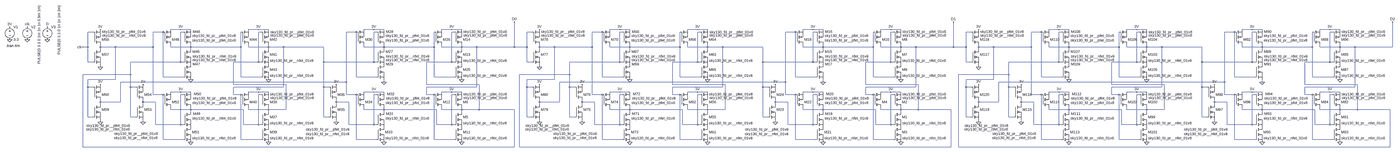
[diagram p0: schematic FETDFF(debug).asc, whole sheet]
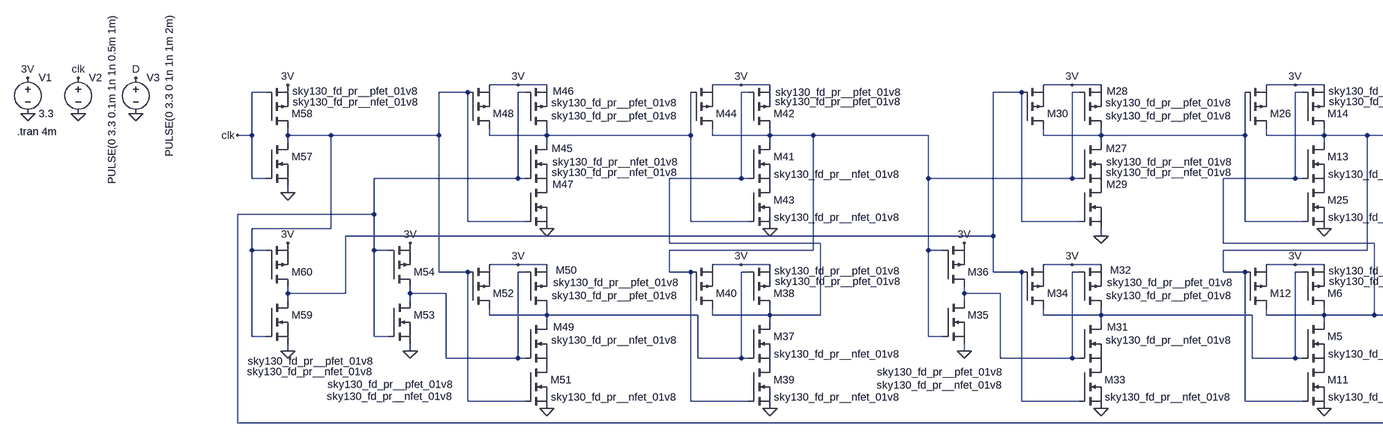
[diagram p1: schematic FETDFF(debug).asc, part, row 1 of 1, column 1 of 3]
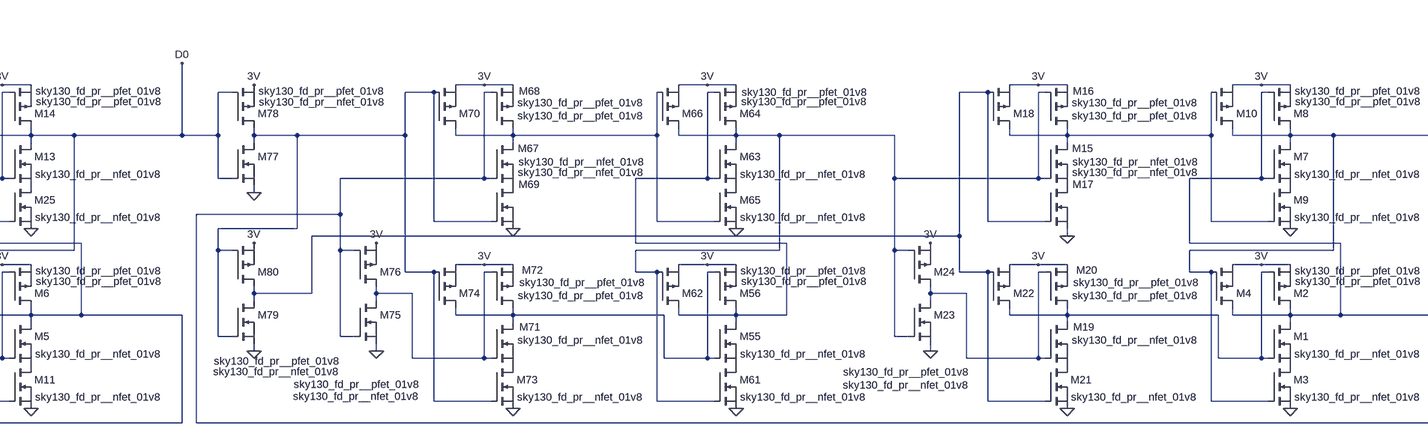
[diagram p2: schematic FETDFF(debug).asc, part, row 1 of 1, column 2 of 3]
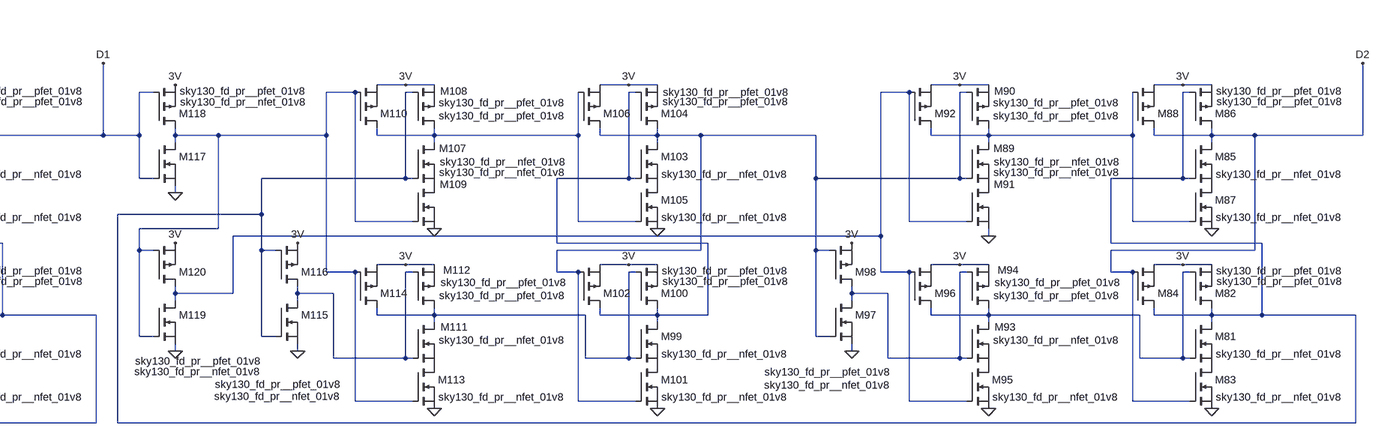
[diagram p3: schematic FETDFF(debug).asc, part, row 1 of 1, column 3 of 3]
FETDFF(debug).asc, the LTspice schematic file:
Version 4
SHEET 1 8612 680
WIRE 112 -1616 48 -1616
WIRE 176 -1616 112 -1616
WIRE 608 -1616 544 -1616
WIRE 672 -1616 608 -1616
WIRE 1344 -1616 1280 -1616
WIRE 1408 -1616 1344 -1616
WIRE 1840 -1616 1776 -1616
WIRE 1904 -1616 1840 -1616
WIRE 2912 -1616 2848 -1616
WIRE 2976 -1616 2912 -1616
WIRE 3408 -1616 3344 -1616
WIRE 3472 -1616 3408 -1616
WIRE 4144 -1616 4080 -1616
WIRE 4208 -1616 4144 -1616
WIRE 4640 -1616 4576 -1616
WIRE 4704 -1616 4640 -1616
WIRE 5712 -1616 5648 -1616
WIRE 5776 -1616 5712 -1616
WIRE 6208 -1616 6144 -1616
WIRE 6272 -1616 6208 -1616
WIRE 6944 -1616 6880 -1616
WIRE 7008 -1616 6944 -1616
WIRE 7440 -1616 7376 -1616
WIRE 7504 -1616 7440 -1616
WIRE -448 -1600 -480 -1600
WIRE 0 -1600 -64 -1600
WIRE 128 -1600 112 -1600
WIRE 624 -1600 608 -1600
WIRE 1232 -1600 1168 -1600
WIRE 1360 -1600 1344 -1600
WIRE 1856 -1600 1840 -1600
WIRE 2352 -1600 2320 -1600
WIRE 2800 -1600 2736 -1600
WIRE 2928 -1600 2912 -1600
WIRE 3424 -1600 3408 -1600
WIRE 4032 -1600 3968 -1600
WIRE 4160 -1600 4144 -1600
WIRE 4656 -1600 4640 -1600
WIRE 5152 -1600 5120 -1600
WIRE 5600 -1600 5536 -1600
WIRE 5728 -1600 5712 -1600
WIRE 6224 -1600 6208 -1600
WIRE 6832 -1600 6768 -1600
WIRE 6960 -1600 6944 -1600
WIRE 7456 -1600 7440 -1600
WIRE -480 -1504 -480 -1600
WIRE -480 -1504 -512 -1504
WIRE -400 -1504 -400 -1520
WIRE -304 -1504 -400 -1504
WIRE -64 -1504 -64 -1600
WIRE -64 -1504 -304 -1504
WIRE 48 -1504 48 -1520
WIRE 176 -1504 176 -1520
WIRE 176 -1504 48 -1504
WIRE 496 -1504 496 -1600
WIRE 496 -1504 176 -1504
WIRE 544 -1504 544 -1520
WIRE 672 -1504 672 -1520
WIRE 672 -1504 544 -1504
WIRE 768 -1504 672 -1504
WIRE 1024 -1504 768 -1504
WIRE 1280 -1504 1280 -1520
WIRE 1408 -1504 1408 -1520
WIRE 1408 -1504 1280 -1504
WIRE 1728 -1504 1728 -1600
WIRE 1728 -1504 1408 -1504
WIRE 1776 -1504 1776 -1520
WIRE 1904 -1504 1904 -1520
WIRE 1904 -1504 1776 -1504
WIRE 2000 -1504 1904 -1504
WIRE 2240 -1504 2240 -1664
WIRE 2240 -1504 2000 -1504
WIRE 2320 -1504 2320 -1600
WIRE 2320 -1504 2240 -1504
WIRE 2400 -1504 2400 -1520
WIRE 2496 -1504 2400 -1504
WIRE 2736 -1504 2736 -1600
WIRE 2736 -1504 2496 -1504
WIRE 2848 -1504 2848 -1520
WIRE 2976 -1504 2976 -1520
WIRE 2976 -1504 2848 -1504
WIRE 3296 -1504 3296 -1600
WIRE 3296 -1504 2976 -1504
WIRE 3344 -1504 3344 -1520
WIRE 3472 -1504 3472 -1520
WIRE 3472 -1504 3344 -1504
WIRE 3568 -1504 3472 -1504
WIRE 3824 -1504 3568 -1504
WIRE 4080 -1504 4080 -1520
WIRE 4208 -1504 4208 -1520
WIRE 4208 -1504 4080 -1504
WIRE 4528 -1504 4528 -1600
WIRE 4528 -1504 4208 -1504
WIRE 4576 -1504 4576 -1520
WIRE 4704 -1504 4704 -1520
WIRE 4704 -1504 4576 -1504
WIRE 4800 -1504 4704 -1504
WIRE 5040 -1504 5040 -1664
WIRE 5040 -1504 4800 -1504
WIRE 5120 -1504 5120 -1600
WIRE 5120 -1504 5040 -1504
WIRE 5200 -1504 5200 -1520
WIRE 5296 -1504 5200 -1504
WIRE 5536 -1504 5536 -1600
WIRE 5536 -1504 5296 -1504
WIRE 5648 -1504 5648 -1520
WIRE 5776 -1504 5776 -1520
WIRE 5776 -1504 5648 -1504
WIRE 6096 -1504 6096 -1600
WIRE 6096 -1504 5776 -1504
WIRE 6144 -1504 6144 -1520
WIRE 6272 -1504 6272 -1520
WIRE 6272 -1504 6144 -1504
WIRE 6368 -1504 6272 -1504
WIRE 6624 -1504 6368 -1504
WIRE 6880 -1504 6880 -1520
WIRE 7008 -1504 7008 -1520
WIRE 7008 -1504 6880 -1504
WIRE 7328 -1504 7328 -1600
WIRE 7328 -1504 7008 -1504
WIRE 7376 -1504 7376 -1520
WIRE 7504 -1504 7504 -1520
WIRE 7504 -1504 7376 -1504
WIRE 7600 -1504 7504 -1504
WIRE 7840 -1504 7840 -1664
WIRE 7840 -1504 7600 -1504
WIRE -400 -1488 -400 -1504
WIRE 176 -1488 176 -1504
WIRE 672 -1488 672 -1504
WIRE 1408 -1488 1408 -1504
WIRE 1904 -1488 1904 -1504
WIRE 2400 -1488 2400 -1504
WIRE 2976 -1488 2976 -1504
WIRE 3472 -1488 3472 -1504
WIRE 4208 -1488 4208 -1504
WIRE 4704 -1488 4704 -1504
WIRE 5200 -1488 5200 -1504
WIRE 5776 -1488 5776 -1504
WIRE 6272 -1488 6272 -1504
WIRE 7008 -1488 7008 -1504
WIRE 7504 -1488 7504 -1504
WIRE -480 -1408 -480 -1504
WIRE -448 -1408 -480 -1408
WIRE 112 -1408 112 -1600
WIRE 112 -1408 -208 -1408
WIRE 128 -1408 112 -1408
WIRE 608 -1408 608 -1600
WIRE 608 -1408 448 -1408
WIRE 624 -1408 608 -1408
WIRE 1024 -1408 1024 -1504
WIRE 1344 -1408 1344 -1600
WIRE 1344 -1408 1024 -1408
WIRE 1360 -1408 1344 -1408
WIRE 1840 -1408 1840 -1600
WIRE 1840 -1408 1680 -1408
WIRE 1856 -1408 1840 -1408
WIRE 2320 -1408 2320 -1504
WIRE 2352 -1408 2320 -1408
WIRE 2912 -1408 2912 -1600
WIRE 2912 -1408 2592 -1408
WIRE 2928 -1408 2912 -1408
WIRE 3408 -1408 3408 -1600
WIRE 3408 -1408 3248 -1408
WIRE 3424 -1408 3408 -1408
WIRE 3824 -1408 3824 -1504
WIRE 4144 -1408 4144 -1600
WIRE 4144 -1408 3824 -1408
WIRE 4160 -1408 4144 -1408
WIRE 4640 -1408 4640 -1600
WIRE 4640 -1408 4480 -1408
WIRE 4656 -1408 4640 -1408
WIRE 5120 -1408 5120 -1504
WIRE 5152 -1408 5120 -1408
WIRE 5712 -1408 5712 -1600
WIRE 5712 -1408 5392 -1408
WIRE 5728 -1408 5712 -1408
WIRE 6208 -1408 6208 -1600
WIRE 6208 -1408 6048 -1408
WIRE 6224 -1408 6208 -1408
WIRE 6624 -1408 6624 -1504
WIRE 6944 -1408 6944 -1600
WIRE 6944 -1408 6624 -1408
WIRE 6960 -1408 6944 -1408
WIRE 7440 -1408 7440 -1600
WIRE 7440 -1408 7280 -1408
WIRE 7456 -1408 7440 -1408
WIRE -400 -1376 -400 -1392
WIRE 2400 -1376 2400 -1392
WIRE 5200 -1376 5200 -1392
WIRE -208 -1328 -208 -1408
WIRE -208 -1328 -512 -1328
WIRE 2592 -1328 2592 -1408
WIRE 2592 -1328 2272 -1328
WIRE 5392 -1328 5392 -1408
WIRE 5392 -1328 5072 -1328
WIRE 0 -1312 0 -1600
WIRE 128 -1312 0 -1312
WIRE 496 -1312 496 -1504
WIRE 624 -1312 496 -1312
WIRE 1232 -1312 1232 -1600
WIRE 1360 -1312 1232 -1312
WIRE 1728 -1312 1728 -1504
WIRE 1856 -1312 1728 -1312
WIRE 2800 -1312 2800 -1600
WIRE 2928 -1312 2800 -1312
WIRE 3296 -1312 3296 -1504
WIRE 3424 -1312 3296 -1312
WIRE 4032 -1312 4032 -1600
WIRE 4160 -1312 4032 -1312
WIRE 4528 -1312 4528 -1504
WIRE 4656 -1312 4528 -1312
WIRE 5600 -1312 5600 -1600
WIRE 5728 -1312 5600 -1312
WIRE 6096 -1312 6096 -1504
WIRE 6224 -1312 6096 -1312
WIRE 6832 -1312 6832 -1600
WIRE 6960 -1312 6832 -1312
WIRE 7328 -1312 7328 -1504
WIRE 7456 -1312 7328 -1312
WIRE -304 -1296 -304 -1504
WIRE -304 -1296 -480 -1296
WIRE 2496 -1296 2496 -1504
WIRE 2496 -1296 2320 -1296
WIRE 5296 -1296 5296 -1504
WIRE 5296 -1296 5120 -1296
WIRE 1168 -1280 1168 -1600
WIRE 1168 -1280 -272 -1280
WIRE 1408 -1280 1408 -1296
WIRE 3968 -1280 3968 -1600
WIRE 3968 -1280 2528 -1280
WIRE 4208 -1280 4208 -1296
WIRE 6768 -1280 6768 -1600
WIRE 6768 -1280 5328 -1280
WIRE 7008 -1280 7008 -1296
WIRE 448 -1264 448 -1408
WIRE 784 -1264 448 -1264
WIRE 1680 -1264 1680 -1408
WIRE 2016 -1264 1680 -1264
WIRE 3248 -1264 3248 -1408
WIRE 3584 -1264 3248 -1264
WIRE 4480 -1264 4480 -1408
WIRE 4816 -1264 4480 -1264
WIRE 6048 -1264 6048 -1408
WIRE 6384 -1264 6048 -1264
WIRE 7280 -1264 7280 -1408
WIRE 7616 -1264 7280 -1264
WIRE -480 -1248 -480 -1296
WIRE -448 -1248 -480 -1248
WIRE -208 -1248 -208 -1328
WIRE -176 -1248 -208 -1248
WIRE 768 -1248 768 -1504
WIRE 768 -1248 448 -1248
WIRE 1024 -1248 1024 -1408
WIRE 1056 -1248 1024 -1248
WIRE 2000 -1248 2000 -1504
WIRE 2000 -1248 1680 -1248
WIRE 2320 -1248 2320 -1296
WIRE 2352 -1248 2320 -1248
WIRE 2592 -1248 2592 -1328
WIRE 2624 -1248 2592 -1248
WIRE 3568 -1248 3568 -1504
WIRE 3568 -1248 3248 -1248
WIRE 3824 -1248 3824 -1408
WIRE 3856 -1248 3824 -1248
WIRE 4800 -1248 4800 -1504
WIRE 4800 -1248 4480 -1248
WIRE 5120 -1248 5120 -1296
WIRE 5152 -1248 5120 -1248
WIRE 5392 -1248 5392 -1328
WIRE 5424 -1248 5392 -1248
WIRE 6368 -1248 6368 -1504
WIRE 6368 -1248 6048 -1248
WIRE 6624 -1248 6624 -1408
WIRE 6656 -1248 6624 -1248
WIRE 7600 -1248 7600 -1504
WIRE 7600 -1248 7280 -1248
WIRE 112 -1216 48 -1216
WIRE 176 -1216 112 -1216
WIRE 608 -1216 544 -1216
WIRE 672 -1216 608 -1216
WIRE 1344 -1216 1280 -1216
WIRE 1408 -1216 1344 -1216
WIRE 1840 -1216 1776 -1216
WIRE 1904 -1216 1840 -1216
WIRE 2912 -1216 2848 -1216
WIRE 2976 -1216 2912 -1216
WIRE 3408 -1216 3344 -1216
WIRE 3472 -1216 3408 -1216
WIRE 4144 -1216 4080 -1216
WIRE 4208 -1216 4144 -1216
WIRE 4640 -1216 4576 -1216
WIRE 4704 -1216 4640 -1216
WIRE 5712 -1216 5648 -1216
WIRE 5776 -1216 5712 -1216
WIRE 6208 -1216 6144 -1216
WIRE 6272 -1216 6208 -1216
WIRE 6944 -1216 6880 -1216
WIRE 7008 -1216 6944 -1216
WIRE 7440 -1216 7376 -1216
WIRE 7504 -1216 7440 -1216
WIRE -64 -1200 -64 -1504
WIRE 0 -1200 -64 -1200
WIRE 128 -1200 112 -1200
WIRE 448 -1200 448 -1248
WIRE 496 -1200 448 -1200
WIRE 624 -1200 608 -1200
WIRE 1168 -1200 1168 -1280
WIRE 1232 -1200 1168 -1200
WIRE 1360 -1200 1344 -1200
WIRE 1680 -1200 1680 -1248
WIRE 1728 -1200 1680 -1200
WIRE 1856 -1200 1840 -1200
WIRE 2736 -1200 2736 -1504
WIRE 2800 -1200 2736 -1200
WIRE 2928 -1200 2912 -1200
WIRE 3248 -1200 3248 -1248
WIRE 3296 -1200 3248 -1200
WIRE 3424 -1200 3408 -1200
WIRE 3968 -1200 3968 -1280
WIRE 4032 -1200 3968 -1200
WIRE 4160 -1200 4144 -1200
WIRE 4480 -1200 4480 -1248
WIRE 4528 -1200 4480 -1200
WIRE 4656 -1200 4640 -1200
WIRE 5536 -1200 5536 -1504
WIRE 5600 -1200 5536 -1200
WIRE 5728 -1200 5712 -1200
WIRE 6048 -1200 6048 -1248
WIRE 6096 -1200 6048 -1200
WIRE 6224 -1200 6208 -1200
WIRE 6768 -1200 6768 -1280
WIRE 6832 -1200 6768 -1200
WIRE 6960 -1200 6944 -1200
WIRE 7280 -1200 7280 -1248
WIRE 7328 -1200 7280 -1200
WIRE 7456 -1200 7440 -1200
WIRE -400 -1152 -400 -1168
WIRE -272 -1152 -272 -1280
WIRE -272 -1152 -400 -1152
WIRE -128 -1152 -128 -1168
WIRE -48 -1152 -128 -1152
WIRE 1104 -1152 1104 -1168
WIRE 1184 -1152 1104 -1152
WIRE 2400 -1152 2400 -1168
WIRE 2528 -1152 2528 -1280
WIRE 2528 -1152 2400 -1152
WIRE 2672 -1152 2672 -1168
WIRE 2752 -1152 2672 -1152
WIRE 3904 -1152 3904 -1168
WIRE 3984 -1152 3904 -1152
WIRE 5200 -1152 5200 -1168
WIRE 5328 -1152 5328 -1280
WIRE 5328 -1152 5200 -1152
WIRE 5472 -1152 5472 -1168
WIRE 5552 -1152 5472 -1152
WIRE 6704 -1152 6704 -1168
WIRE 6784 -1152 6704 -1152
WIRE -400 -1136 -400 -1152
WIRE -128 -1136 -128 -1152
WIRE 1104 -1136 1104 -1152
WIRE 2400 -1136 2400 -1152
WIRE 2672 -1136 2672 -1152
WIRE 3904 -1136 3904 -1152
WIRE 5200 -1136 5200 -1152
WIRE 5472 -1136 5472 -1152
WIRE 6704 -1136 6704 -1152
WIRE 48 -1104 48 -1120
WIRE 176 -1104 176 -1120
WIRE 176 -1104 48 -1104
WIRE 512 -1104 176 -1104
WIRE 544 -1104 544 -1120
WIRE 672 -1104 672 -1120
WIRE 672 -1104 544 -1104
WIRE 784 -1104 784 -1264
WIRE 784 -1104 672 -1104
WIRE 1280 -1104 1280 -1120
WIRE 1408 -1104 1408 -1120
WIRE 1408 -1104 1280 -1104
WIRE 1744 -1104 1408 -1104
WIRE 1776 -1104 1776 -1120
WIRE 1904 -1104 1904 -1120
WIRE 1904 -1104 1776 -1104
WIRE 2016 -1104 2016 -1264
WIRE 2016 -1104 1904 -1104
WIRE 2240 -1104 2016 -1104
WIRE 2848 -1104 2848 -1120
WIRE 2976 -1104 2976 -1120
WIRE 2976 -1104 2848 -1104
WIRE 3312 -1104 2976 -1104
WIRE 3344 -1104 3344 -1120
WIRE 3472 -1104 3472 -1120
WIRE 3472 -1104 3344 -1104
WIRE 3584 -1104 3584 -1264
WIRE 3584 -1104 3472 -1104
WIRE 4080 -1104 4080 -1120
WIRE 4208 -1104 4208 -1120
WIRE 4208 -1104 4080 -1104
WIRE 4544 -1104 4208 -1104
WIRE 4576 -1104 4576 -1120
WIRE 4704 -1104 4704 -1120
WIRE 4704 -1104 4576 -1104
WIRE 4816 -1104 4816 -1264
WIRE 4816 -1104 4704 -1104
WIRE 5024 -1104 4816 -1104
WIRE 5648 -1104 5648 -1120
WIRE 5776 -1104 5776 -1120
WIRE 5776 -1104 5648 -1104
WIRE 6112 -1104 5776 -1104
WIRE 6144 -1104 6144 -1120
WIRE 6272 -1104 6272 -1120
WIRE 6272 -1104 6144 -1104
WIRE 6384 -1104 6384 -1264
WIRE 6384 -1104 6272 -1104
WIRE 6880 -1104 6880 -1120
WIRE 7008 -1104 7008 -1120
WIRE 7008 -1104 6880 -1104
WIRE 7344 -1104 7008 -1104
WIRE 7376 -1104 7376 -1120
WIRE 7504 -1104 7504 -1120
WIRE 7504 -1104 7376 -1104
WIRE 7616 -1104 7616 -1264
WIRE 7616 -1104 7504 -1104
WIRE 7824 -1104 7616 -1104
WIRE 176 -1088 176 -1104
WIRE 672 -1088 672 -1104
WIRE 1408 -1088 1408 -1104
WIRE 1904 -1088 1904 -1104
WIRE 2976 -1088 2976 -1104
WIRE 3472 -1088 3472 -1104
WIRE 4208 -1088 4208 -1104
WIRE 4704 -1088 4704 -1104
WIRE 5776 -1088 5776 -1104
WIRE 6272 -1088 6272 -1104
WIRE 7008 -1088 7008 -1104
WIRE 7504 -1088 7504 -1104
WIRE -480 -1056 -480 -1248
WIRE -448 -1056 -480 -1056
WIRE -208 -1056 -208 -1248
WIRE -176 -1056 -208 -1056
WIRE 1024 -1056 1024 -1248
WIRE 1056 -1056 1024 -1056
WIRE 2320 -1056 2320 -1248
WIRE 2352 -1056 2320 -1056
WIRE 2592 -1056 2592 -1248
WIRE 2624 -1056 2592 -1056
WIRE 3824 -1056 3824 -1248
WIRE 3856 -1056 3824 -1056
WIRE 5120 -1056 5120 -1248
WIRE 5152 -1056 5120 -1056
WIRE 5392 -1056 5392 -1248
WIRE 5424 -1056 5392 -1056
WIRE 6624 -1056 6624 -1248
WIRE 6656 -1056 6624 -1056
WIRE -400 -1024 -400 -1040
WIRE -128 -1024 -128 -1040
WIRE 1104 -1024 1104 -1040
WIRE 2400 -1024 2400 -1040
WIRE 2672 -1024 2672 -1040
WIRE 3904 -1024 3904 -1040
WIRE 5200 -1024 5200 -1040
WIRE 5472 -1024 5472 -1040
WIRE 6704 -1024 6704 -1040
WIRE -48 -1008 -48 -1152
WIRE 112 -1008 112 -1200
WIRE 112 -1008 -48 -1008
WIRE 128 -1008 112 -1008
WIRE 512 -1008 512 -1104
WIRE 608 -1008 608 -1200
WIRE 608 -1008 512 -1008
WIRE 624 -1008 608 -1008
WIRE 1184 -1008 1184 -1152
WIRE 1344 -1008 1344 -1200
WIRE 1344 -1008 1184 -1008
WIRE 1360 -1008 1344 -1008
WIRE 1744 -1008 1744 -1104
WIRE 1840 -1008 1840 -1200
WIRE 1840 -1008 1744 -1008
WIRE 1856 -1008 1840 -1008
WIRE 2752 -1008 2752 -1152
WIRE 2912 -1008 2912 -1200
WIRE 2912 -1008 2752 -1008
WIRE 2928 -1008 2912 -1008
WIRE 3312 -1008 3312 -1104
WIRE 3408 -1008 3408 -1200
WIRE 3408 -1008 3312 -1008
WIRE 3424 -1008 3408 -1008
WIRE 3984 -1008 3984 -1152
WIRE 4144 -1008 4144 -1200
WIRE 4144 -1008 3984 -1008
WIRE 4160 -1008 4144 -1008
WIRE 4544 -1008 4544 -1104
WIRE 4640 -1008 4640 -1200
WIRE 4640 -1008 4544 -1008
WIRE 4656 -1008 4640 -1008
WIRE 5552 -1008 5552 -1152
WIRE 5712 -1008 5712 -1200
WIRE 5712 -1008 5552 -1008
WIRE 5728 -1008 5712 -1008
WIRE 6112 -1008 6112 -1104
WIRE 6208 -1008 6208 -1200
WIRE 6208 -1008 6112 -1008
WIRE 6224 -1008 6208 -1008
WIRE 6784 -1008 6784 -1152
WIRE 6944 -1008 6944 -1200
WIRE 6944 -1008 6784 -1008
WIRE 6960 -1008 6944 -1008
WIRE 7344 -1008 7344 -1104
WIRE 7440 -1008 7440 -1200
WIRE 7440 -1008 7344 -1008
WIRE 7456 -1008 7440 -1008
WIRE 0 -912 0 -1200
WIRE 128 -912 0 -912
WIRE 496 -912 496 -1200
WIRE 624 -912 496 -912
WIRE 1232 -912 1232 -1200
WIRE 1360 -912 1232 -912
WIRE 1728 -912 1728 -1200
WIRE 1856 -912 1728 -912
WIRE 2800 -912 2800 -1200
WIRE 2928 -912 2800 -912
WIRE 3296 -912 3296 -1200
WIRE 3424 -912 3296 -912
WIRE 4032 -912 4032 -1200
WIRE 4160 -912 4032 -912
WIRE 4528 -912 4528 -1200
WIRE 4656 -912 4528 -912
WIRE 5600 -912 5600 -1200
WIRE 5728 -912 5600 -912
WIRE 6096 -912 6096 -1200
WIRE 6224 -912 6096 -912
WIRE 6832 -912 6832 -1200
WIRE 6960 -912 6832 -912
WIRE 7328 -912 7328 -1200
WIRE 7456 -912 7328 -912
WIRE -512 -864 -512 -1328
WIRE 2240 -864 2240 -1104
WIRE 2240 -864 -512 -864
WIRE 2272 -864 2272 -1328
WIRE 5024 -864 5024 -1104
WIRE 5024 -864 2272 -864
WIRE 5072 -864 5072 -1328
WIRE 7824 -864 7824 -1104
WIRE 7824 -864 5072 -864
FLAG -4400 -1552 0
FLAG -4400 -1632 3V
FLAG -4288 -1552 0
FLAG -4160 -1632 D
FLAG -4160 -1552 0
FLAG 1840 -1216 3V
FLAG 1904 -896 0
FLAG 1840 -1616 3V
FLAG 1904 -1296 0
FLAG 1344 -1616 3V
FLAG 1408 -1280 0
FLAG 1344 -1216 3V
FLAG 1408 -896 0
FLAG 1104 -1264 3V
FLAG 1104 -1024 0
FLAG 608 -1216 3V
FLAG 672 -896 0
FLAG 608 -1616 3V
FLAG 672 -1296 0
FLAG 112 -1616 3V
FLAG 112 -1216 3V
FLAG 176 -896 0
FLAG -128 -1264 3V
FLAG -128 -1024 0
FLAG -400 -1616 3V
FLAG -400 -1376 0
FLAG -400 -1264 3V
FLAG -400 -1024 0
FLAG -512 -1504 clk
FLAG 176 -1296 0
FLAG -4288 -1632 clk
FLAG 4640 -1216 3V
FLAG 4704 -896 0
FLAG 4640 -1616 3V
FLAG 4704 -1296 0
FLAG 4144 -1616 3V
FLAG 4208 -1280 0
FLAG 4144 -1216 3V
FLAG 4208 -896 0
FLAG 3904 -1264 3V
FLAG 3904 -1024 0
FLAG 3408 -1216 3V
FLAG 3472 -896 0
FLAG 3408 -1616 3V
FLAG 3472 -1296 0
FLAG 2912 -1616 3V
FLAG 2912 -1216 3V
FLAG 2976 -896 0
FLAG 2672 -1264 3V
FLAG 2672 -1024 0
FLAG 2400 -1616 3V
FLAG 2400 -1376 0
FLAG 2400 -1264 3V
FLAG 2400 -1024 0
FLAG 2976 -1296 0
FLAG 7440 -1216 3V
FLAG 7504 -896 0
FLAG 7440 -1616 3V
FLAG 7504 -1296 0
FLAG 6944 -1616 3V
FLAG 7008 -1280 0
FLAG 6944 -1216 3V
FLAG 7008 -896 0
FLAG 6704 -1264 3V
FLAG 6704 -1024 0
FLAG 6208 -1216 3V
FLAG 6272 -896 0
FLAG 6208 -1616 3V
FLAG 6272 -1296 0
FLAG 5712 -1616 3V
FLAG 5712 -1216 3V
FLAG 5776 -896 0
FLAG 5472 -1264 3V
FLAG 5472 -1024 0
FLAG 5200 -1616 3V
FLAG 5200 -1376 0
FLAG 5200 -1264 3V
FLAG 5200 -1024 0
FLAG 5776 -1296 0
FLAG 2240 -1664 D0
FLAG 5040 -1664 D1
FLAG 7840 -1664 D2
SYMBOL voltage -4400 -1648 R0
WINDOW 123 0 0 Left 0
WINDOW 39 0 0 Left 0
SYMATTR InstName V1
SYMATTR Value 3.3
SYMBOL voltage -4288 -1648 R0
WINDOW 3 75 -125 VRight 2
WINDOW 123 0 0 Left 0
WINDOW 39 0 0 Left 0
SYMATTR Value PULSE(0 3.3 0.1m 1n 1n 0.5m 1m)
SYMATTR InstName V2
SYMBOL voltage -4160 -1648 R0
WINDOW 3 75 -125 VRight 2
WINDOW 123 0 0 Left 0
WINDOW 39 0 0 Left 0
SYMATTR Value PULSE(0 3.3 0 1n 1n 1m 2m)
SYMATTR InstName V3
SYMBOL nmos 1856 -1088 R0
WINDOW 3 57 71 Left 2
SYMATTR Value sky130_fd_pr__nfet_01v8
SYMATTR InstName M5
SYMBOL pmos 1856 -1120 M180
WINDOW 3 58 82 Left 2
SYMATTR Value sky130_fd_pr__pfet_01v8
SYMATTR InstName M6
SYMBOL nmos 1856 -992 R0
WINDOW 3 57 71 Left 2
SYMATTR Value sky130_fd_pr__nfet_01v8
SYMATTR InstName M11
SYMBOL pmos 1728 -1120 M180
WINDOW 3 187 59 Left 2
SYMATTR Value sky130_fd_pr__pfet_01v8
SYMATTR InstName M12
SYMBOL nmos 1856 -1488 R0
WINDOW 3 57 71 Left 2
SYMATTR Value sky130_fd_pr__nfet_01v8
SYMATTR InstName M13
SYMBOL pmos 1856 -1520 M180
WINDOW 3 58 82 Left 2
SYMATTR Value sky130_fd_pr__pfet_01v8
SYMATTR InstName M14
SYMBOL nmos 1856 -1392 R0
WINDOW 3 57 71 Left 2
SYMATTR Value sky130_fd_pr__nfet_01v8
SYMATTR InstName M25
SYMBOL pmos 1728 -1520 M180
WINDOW 3 187 59 Left 2
SYMATTR Value sky130_fd_pr__pfet_01v8
SYMATTR InstName M26
SYMBOL nmos 1360 -1488 R0
WINDOW 3 60 43 Left 2
WINDOW 0 59 13 Left 2
SYMATTR Value sky130_fd_pr__nfet_01v8
SYMATTR InstName M27
SYMBOL pmos 1360 -1520 M180
WINDOW 3 58 56 Left 2
WINDOW 0 61 82 Left 2
SYMATTR Value sky130_fd_pr__pfet_01v8
SYMATTR InstName M28
SYMBOL nmos 1360 -1392 R0
WINDOW 3 59 -29 Left 2
WINDOW 0 60 -3 Left 2
SYMATTR Value sky130_fd_pr__nfet_01v8
SYMATTR InstName M29
SYMBOL pmos 1232 -1520 M180
WINDOW 3 186 27 Left 2
SYMATTR Value sky130_fd_pr__pfet_01v8
SYMATTR InstName M30
SYMBOL nmos 1360 -1088 R0
WINDOW 3 58 40 Left 2
WINDOW 0 62 11 Left 2
SYMATTR Value sky130_fd_pr__nfet_01v8
SYMATTR InstName M31
SYMBOL pmos 1360 -1120 M180
WINDOW 3 62 56 Left 2
WINDOW 0 68 84 Left 2
SYMATTR Value sky130_fd_pr__pfet_01v8
SYMATTR InstName M32
SYMBOL nmos 1360 -992 R0
WINDOW 3 57 71 Left 2
SYMATTR Value sky130_fd_pr__nfet_01v8
SYMATTR InstName M33
SYMBOL pmos 1232 -1120 M180
WINDOW 3 187 27 Left 2
SYMATTR Value sky130_fd_pr__pfet_01v8
SYMATTR InstName M34
SYMBOL nmos 1056 -1136 R0
WINDOW 3 -147 188 Left 2
SYMATTR Value sky130_fd_pr__nfet_01v8
SYMATTR InstName M35
SYMBOL pmos 1056 -1168 M180
WINDOW 3 -146 -191 Left 2
SYMATTR Value sky130_fd_pr__pfet_01v8
SYMATTR InstName M36
SYMBOL nmos 624 -1088 R0
WINDOW 3 57 71 Left 2
SYMATTR Value sky130_fd_pr__nfet_01v8
SYMATTR InstName M37
SYMBOL pmos 624 -1120 M180
WINDOW 3 58 82 Left 2
SYMATTR Value sky130_fd_pr__pfet_01v8
SYMATTR InstName M38
SYMBOL nmos 624 -992 R0
WINDOW 3 57 71 Left 2
SYMATTR Value sky130_fd_pr__nfet_01v8
SYMATTR InstName M39
SYMBOL pmos 496 -1120 M180
WINDOW 3 187 59 Left 2
SYMATTR Value sky130_fd_pr__pfet_01v8
SYMATTR InstName M40
SYMBOL nmos 624 -1488 R0
WINDOW 3 57 71 Left 2
SYMATTR Value sky130_fd_pr__nfet_01v8
SYMATTR InstName M41
SYMBOL pmos 624 -1520 M180
WINDOW 3 60 80 Left 2
SYMATTR Value sky130_fd_pr__pfet_01v8
SYMATTR InstName M42
SYMBOL nmos 624 -1392 R0
WINDOW 3 57 71 Left 2
SYMATTR Value sky130_fd_pr__nfet_01v8
SYMATTR InstName M43
SYMBOL pmos 496 -1520 M180
WINDOW 3 187 59 Left 2
SYMATTR Value sky130_fd_pr__pfet_01v8
SYMATTR InstName M44
SYMBOL nmos 128 -1488 R0
WINDOW 3 60 43 Left 2
WINDOW 0 59 13 Left 2
SYMATTR Value sky130_fd_pr__nfet_01v8
SYMATTR InstName M45
SYMBOL pmos 128 -1520 M180
WINDOW 3 58 56 Left 2
WINDOW 0 61 82 Left 2
SYMATTR Value sky130_fd_pr__pfet_01v8
SYMATTR InstName M46
SYMBOL nmos 128 -1392 R0
WINDOW 3 59 -29 Left 2
WINDOW 0 60 -3 Left 2
SYMATTR Value sky130_fd_pr__nfet_01v8
SYMATTR InstName M47
SYMBOL pmos 0 -1520 M180
WINDOW 3 186 27 Left 2
SYMATTR Value sky130_fd_pr__pfet_01v8
SYMATTR InstName M48
SYMBOL nmos 128 -1088 R0
WINDOW 3 58 40 Left 2
WINDOW 0 62 11 Left 2
SYMATTR Value sky130_fd_pr__nfet_01v8
SYMATTR InstName M49
SYMBOL pmos 128 -1120 M180
WINDOW 3 62 56 Left 2
WINDOW 0 68 84 Left 2
SYMATTR Value sky130_fd_pr__pfet_01v8
SYMATTR InstName M50
SYMBOL nmos 128 -992 R0
WINDOW 3 57 71 Left 2
SYMATTR Value sky130_fd_pr__nfet_01v8
SYMATTR InstName M51
SYMBOL pmos 0 -1120 M180
WINDOW 3 187 27 Left 2
SYMATTR Value sky130_fd_pr__pfet_01v8
SYMATTR InstName M52
SYMBOL nmos -176 -1136 R0
WINDOW 3 -137 213 Left 2
SYMATTR Value sky130_fd_pr__nfet_01v8
SYMATTR InstName M53
SYMBOL pmos -176 -1168 M180
WINDOW 3 -136 -218 Left 2
SYMATTR Value sky130_fd_pr__pfet_01v8
SYMATTR InstName M54
SYMBOL nmos -448 -1488 R0
WINDOW 3 59 -90 Left 2
SYMATTR Value sky130_fd_pr__nfet_01v8
SYMATTR InstName M57
SYMBOL pmos -448 -1520 M180
WINDOW 3 58 82 Left 2
SYMATTR Value sky130_fd_pr__pfet_01v8
SYMATTR InstName M58
SYMBOL nmos -448 -1136 R0
WINDOW 3 -43 158 Left 2
SYMATTR Value sky130_fd_pr__nfet_01v8
SYMATTR InstName M59
SYMBOL pmos -448 -1168 M180
WINDOW 3 -41 -167 Left 2
SYMATTR Value sky130_fd_pr__pfet_01v8
SYMATTR InstName M60
SYMBOL nmos 4656 -1088 R0
WINDOW 3 57 71 Left 2
SYMATTR Value sky130_fd_pr__nfet_01v8
SYMATTR InstName M1
SYMBOL pmos 4656 -1120 M180
WINDOW 3 58 82 Left 2
SYMATTR Value sky130_fd_pr__pfet_01v8
SYMATTR InstName M2
SYMBOL nmos 4656 -992 R0
WINDOW 3 57 71 Left 2
SYMATTR Value sky130_fd_pr__nfet_01v8
SYMATTR InstName M3
SYMBOL pmos 4528 -1120 M180
WINDOW 3 187 59 Left 2
SYMATTR Value sky130_fd_pr__pfet_01v8
SYMATTR InstName M4
SYMBOL nmos 4656 -1488 R0
WINDOW 3 57 71 Left 2
SYMATTR Value sky130_fd_pr__nfet_01v8
SYMATTR InstName M7
SYMBOL pmos 4656 -1520 M180
WINDOW 3 58 82 Left 2
SYMATTR Value sky130_fd_pr__pfet_01v8
SYMATTR InstName M8
SYMBOL nmos 4656 -1392 R0
WINDOW 3 57 71 Left 2
SYMATTR Value sky130_fd_pr__nfet_01v8
SYMATTR InstName M9
SYMBOL pmos 4528 -1520 M180
WINDOW 3 187 59 Left 2
SYMATTR Value sky130_fd_pr__pfet_01v8
SYMATTR InstName M10
SYMBOL nmos 4160 -1488 R0
WINDOW 3 60 43 Left 2
WINDOW 0 59 13 Left 2
SYMATTR Value sky130_fd_pr__nfet_01v8
SYMATTR InstName M15
SYMBOL pmos 4160 -1520 M180
WINDOW 3 58 56 Left 2
WINDOW 0 61 82 Left 2
SYMATTR Value sky130_fd_pr__pfet_01v8
SYMATTR InstName M16
SYMBOL nmos 4160 -1392 R0
WINDOW 3 59 -29 Left 2
WINDOW 0 60 -3 Left 2
SYMATTR Value sky130_fd_pr__nfet_01v8
SYMATTR InstName M17
SYMBOL pmos 4032 -1520 M180
WINDOW 3 186 27 Left 2
SYMATTR Value sky130_fd_pr__pfet_01v8
SYMATTR InstName M18
SYMBOL nmos 4160 -1088 R0
WINDOW 3 58 40 Left 2
WINDOW 0 62 11 Left 2
SYMATTR Value sky130_fd_pr__nfet_01v8
SYMATTR InstName M19
SYMBOL pmos 4160 -1120 M180
WINDOW 3 62 56 Left 2
WINDOW 0 68 84 Left 2
SYMATTR Value sky130_fd_pr__pfet_01v8
SYMATTR InstName M20
SYMBOL nmos 4160 -992 R0
WINDOW 3 57 71 Left 2
SYMATTR Value sky130_fd_pr__nfet_01v8
SYMATTR InstName M21
SYMBOL pmos 4032 -1120 M180
WINDOW 3 187 27 Left 2
SYMATTR Value sky130_fd_pr__pfet_01v8
SYMATTR InstName M22
SYMBOL nmos 3856 -1136 R0
WINDOW 3 -147 188 Left 2
SYMATTR Value sky130_fd_pr__nfet_01v8
SYMATTR InstName M23
SYMBOL pmos 3856 -1168 M180
WINDOW 3 -146 -191 Left 2
SYMATTR Value sky130_fd_pr__pfet_01v8
SYMATTR InstName M24
SYMBOL nmos 3424 -1088 R0
WINDOW 3 57 71 Left 2
SYMATTR Value sky130_fd_pr__nfet_01v8
SYMATTR InstName M55
SYMBOL pmos 3424 -1120 M180
WINDOW 3 58 82 Left 2
SYMATTR Value sky130_fd_pr__pfet_01v8
SYMATTR InstName M56
SYMBOL nmos 3424 -992 R0
WINDOW 3 57 71 Left 2
SYMATTR Value sky130_fd_pr__nfet_01v8
SYMATTR InstName M61
SYMBOL pmos 3296 -1120 M180
WINDOW 3 187 59 Left 2
SYMATTR Value sky130_fd_pr__pfet_01v8
SYMATTR InstName M62
SYMBOL nmos 3424 -1488 R0
WINDOW 3 57 71 Left 2
SYMATTR Value sky130_fd_pr__nfet_01v8
SYMATTR InstName M63
SYMBOL pmos 3424 -1520 M180
WINDOW 3 60 80 Left 2
SYMATTR Value sky130_fd_pr__pfet_01v8
SYMATTR InstName M64
SYMBOL nmos 3424 -1392 R0
WINDOW 3 57 71 Left 2
SYMATTR Value sky130_fd_pr__nfet_01v8
SYMATTR InstName M65
SYMBOL pmos 3296 -1520 M180
WINDOW 3 187 59 Left 2
SYMATTR Value sky130_fd_pr__pfet_01v8
SYMATTR InstName M66
SYMBOL nmos 2928 -1488 R0
WINDOW 3 60 43 Left 2
WINDOW 0 59 13 Left 2
SYMATTR Value sky130_fd_pr__nfet_01v8
SYMATTR InstName M67
SYMBOL pmos 2928 -1520 M180
WINDOW 3 58 56 Left 2
WINDOW 0 61 82 Left 2
SYMATTR Value sky130_fd_pr__pfet_01v8
SYMATTR InstName M68
SYMBOL nmos 2928 -1392 R0
WINDOW 3 59 -29 Left 2
WINDOW 0 60 -3 Left 2
SYMATTR Value sky130_fd_pr__nfet_01v8
SYMATTR InstName M69
SYMBOL pmos 2800 -1520 M180
WINDOW 3 186 27 Left 2
SYMATTR Value sky130_fd_pr__pfet_01v8
SYMATTR InstName M70
SYMBOL nmos 2928 -1088 R0
WINDOW 3 58 40 Left 2
WINDOW 0 62 11 Left 2
SYMATTR Value sky130_fd_pr__nfet_01v8
SYMATTR InstName M71
SYMBOL pmos 2928 -1120 M180
WINDOW 3 62 56 Left 2
WINDOW 0 68 84 Left 2
SYMATTR Value sky130_fd_pr__pfet_01v8
SYMATTR InstName M72
SYMBOL nmos 2928 -992 R0
WINDOW 3 57 71 Left 2
SYMATTR Value sky130_fd_pr__nfet_01v8
SYMATTR InstName M73
SYMBOL pmos 2800 -1120 M180
WINDOW 3 187 27 Left 2
SYMATTR Value sky130_fd_pr__pfet_01v8
SYMATTR InstName M74
SYMBOL nmos 2624 -1136 R0
WINDOW 3 -137 213 Left 2
SYMATTR Value sky130_fd_pr__nfet_01v8
SYMATTR InstName M75
SYMBOL pmos 2624 -1168 M180
WINDOW 3 -136 -218 Left 2
SYMATTR Value sky130_fd_pr__pfet_01v8
SYMATTR InstName M76
SYMBOL nmos 2352 -1488 R0
WINDOW 3 59 -90 Left 2
SYMATTR Value sky130_fd_pr__nfet_01v8
SYMATTR InstName M77
SYMBOL pmos 2352 -1520 M180
WINDOW 3 58 82 Left 2
SYMATTR Value sky130_fd_pr__pfet_01v8
SYMATTR InstName M78
SYMBOL nmos 2352 -1136 R0
WINDOW 3 -43 158 Left 2
SYMATTR Value sky130_fd_pr__nfet_01v8
SYMATTR InstName M79
SYMBOL pmos 2352 -1168 M180
WINDOW 3 -41 -167 Left 2
SYMATTR Value sky130_fd_pr__pfet_01v8
SYMATTR InstName M80
SYMBOL nmos 7456 -1088 R0
WINDOW 3 57 71 Left 2
SYMATTR Value sky130_fd_pr__nfet_01v8
SYMATTR InstName M81
SYMBOL pmos 7456 -1120 M180
WINDOW 3 58 82 Left 2
SYMATTR Value sky130_fd_pr__pfet_01v8
SYMATTR InstName M82
SYMBOL nmos 7456 -992 R0
WINDOW 3 57 71 Left 2
SYMATTR Value sky130_fd_pr__nfet_01v8
SYMATTR InstName M83
SYMBOL pmos 7328 -1120 M180
WINDOW 3 187 59 Left 2
SYMATTR Value sky130_fd_pr__pfet_01v8
SYMATTR InstName M84
SYMBOL nmos 7456 -1488 R0
WINDOW 3 57 71 Left 2
SYMATTR Value sky130_fd_pr__nfet_01v8
SYMATTR InstName M85
SYMBOL pmos 7456 -1520 M180
WINDOW 3 58 82 Left 2
SYMATTR Value sky130_fd_pr__pfet_01v8
SYMATTR InstName M86
SYMBOL nmos 7456 -1392 R0
WINDOW 3 57 71 Left 2
SYMATTR Value sky130_fd_pr__nfet_01v8
SYMATTR InstName M87
SYMBOL pmos 7328 -1520 M180
WINDOW 3 187 59 Left 2
SYMATTR Value sky130_fd_pr__pfet_01v8
SYMATTR InstName M88
SYMBOL nmos 6960 -1488 R0
WINDOW 3 60 43 Left 2
WINDOW 0 59 13 Left 2
SYMATTR Value sky130_fd_pr__nfet_01v8
SYMATTR InstName M89
SYMBOL pmos 6960 -1520 M180
WINDOW 3 58 56 Left 2
WINDOW 0 61 82 Left 2
SYMATTR Value sky130_fd_pr__pfet_01v8
SYMATTR InstName M90
SYMBOL nmos 6960 -1392 R0
WINDOW 3 59 -29 Left 2
WINDOW 0 60 -3 Left 2
SYMATTR Value sky130_fd_pr__nfet_01v8
SYMATTR InstName M91
SYMBOL pmos 6832 -1520 M180
WINDOW 3 186 27 Left 2
SYMATTR Value sky130_fd_pr__pfet_01v8
SYMATTR InstName M92
SYMBOL nmos 6960 -1088 R0
WINDOW 3 58 40 Left 2
WINDOW 0 62 11 Left 2
SYMATTR Value sky130_fd_pr__nfet_01v8
SYMATTR InstName M93
SYMBOL pmos 6960 -1120 M180
WINDOW 3 62 56 Left 2
WINDOW 0 68 84 Left 2
SYMATTR Value sky130_fd_pr__pfet_01v8
SYMATTR InstName M94
SYMBOL nmos 6960 -992 R0
WINDOW 3 57 71 Left 2
SYMATTR Value sky130_fd_pr__nfet_01v8
SYMATTR InstName M95
SYMBOL pmos 6832 -1120 M180
WINDOW 3 187 27 Left 2
SYMATTR Value sky130_fd_pr__pfet_01v8
SYMATTR InstName M96
SYMBOL nmos 6656 -1136 R0
WINDOW 3 -147 188 Left 2
SYMATTR Value sky130_fd_pr__nfet_01v8
SYMATTR InstName M97
SYMBOL pmos 6656 -1168 M180
WINDOW 3 -146 -191 Left 2
SYMATTR Value sky130_fd_pr__pfet_01v8
SYMATTR InstName M98
SYMBOL nmos 6224 -1088 R0
WINDOW 3 57 71 Left 2
SYMATTR Value sky130_fd_pr__nfet_01v8
SYMATTR InstName M99
SYMBOL pmos 6224 -1120 M180
WINDOW 3 58 82 Left 2
SYMATTR Value sky130_fd_pr__pfet_01v8
SYMATTR InstName M100
SYMBOL nmos 6224 -992 R0
WINDOW 3 57 71 Left 2
SYMATTR Value sky130_fd_pr__nfet_01v8
SYMATTR InstName M101
SYMBOL pmos 6096 -1120 M180
WINDOW 3 187 59 Left 2
SYMATTR Value sky130_fd_pr__pfet_01v8
SYMATTR InstName M102
SYMBOL nmos 6224 -1488 R0
WINDOW 3 57 71 Left 2
SYMATTR Value sky130_fd_pr__nfet_01v8
SYMATTR InstName M103
SYMBOL pmos 6224 -1520 M180
WINDOW 3 60 80 Left 2
SYMATTR Value sky130_fd_pr__pfet_01v8
SYMATTR InstName M104
SYMBOL nmos 6224 -1392 R0
WINDOW 3 57 71 Left 2
SYMATTR Value sky130_fd_pr__nfet_01v8
SYMATTR InstName M105
SYMBOL pmos 6096 -1520 M180
WINDOW 3 187 59 Left 2
SYMATTR Value sky130_fd_pr__pfet_01v8
SYMATTR InstName M106
SYMBOL nmos 5728 -1488 R0
WINDOW 3 60 43 Left 2
WINDOW 0 59 13 Left 2
SYMATTR Value sky130_fd_pr__nfet_01v8
SYMATTR InstName M107
SYMBOL pmos 5728 -1520 M180
WINDOW 3 58 56 Left 2
WINDOW 0 61 82 Left 2
SYMATTR Value sky130_fd_pr__pfet_01v8
SYMATTR InstName M108
SYMBOL nmos 5728 -1392 R0
WINDOW 3 59 -29 Left 2
WINDOW 0 60 -3 Left 2
SYMATTR Value sky130_fd_pr__nfet_01v8
SYMATTR InstName M109
SYMBOL pmos 5600 -1520 M180
WINDOW 3 186 27 Left 2
SYMATTR Value sky130_fd_pr__pfet_01v8
SYMATTR InstName M110
SYMBOL nmos 5728 -1088 R0
WINDOW 3 58 40 Left 2
WINDOW 0 62 11 Left 2
SYMATTR Value sky130_fd_pr__nfet_01v8
SYMATTR InstName M111
SYMBOL pmos 5728 -1120 M180
WINDOW 3 62 56 Left 2
WINDOW 0 68 84 Left 2
SYMATTR Value sky130_fd_pr__pfet_01v8
SYMATTR InstName M112
SYMBOL nmos 5728 -992 R0
WINDOW 3 57 71 Left 2
SYMATTR Value sky130_fd_pr__nfet_01v8
SYMATTR InstName M113
SYMBOL pmos 5600 -1120 M180
WINDOW 3 187 27 Left 2
SYMATTR Value sky130_fd_pr__pfet_01v8
SYMATTR InstName M114
SYMBOL nmos 5424 -1136 R0
WINDOW 3 -137 213 Left 2
SYMATTR Value sky130_fd_pr__nfet_01v8
SYMATTR InstName M115
SYMBOL pmos 5424 -1168 M180
WINDOW 3 -136 -218 Left 2
SYMATTR Value sky130_fd_pr__pfet_01v8
SYMATTR InstName M116
SYMBOL nmos 5152 -1488 R0
WINDOW 3 59 -90 Left 2
SYMATTR Value sky130_fd_pr__nfet_01v8
SYMATTR InstName M117
SYMBOL pmos 5152 -1520 M180
WINDOW 3 58 82 Left 2
SYMATTR Value sky130_fd_pr__pfet_01v8
SYMATTR InstName M118
SYMBOL nmos 5152 -1136 R0
WINDOW 3 -43 158 Left 2
SYMATTR Value sky130_fd_pr__nfet_01v8
SYMATTR InstName M119
SYMBOL pmos 5152 -1168 M180
WINDOW 3 -41 -167 Left 2
SYMATTR Value sky130_fd_pr__pfet_01v8
SYMATTR InstName M120
TEXT -4424 -1512 Left 2 !.tran 4m

The netlist it stands for:
* FETDFF(debug).asc
V1 3V 0 3.3
V2 clk 0 PULSE(0 3.3 0.1m 1n 1n 0.5m 1m)
V3 D 0 PULSE(0 3.3 0 1n 1n 1m 2m)
M5 N002 N025 P001 P001 sky130_fd_pr__nfet_01v8
M6 N002 N025 3V 3V sky130_fd_pr__pfet_01v8
M11 P001 D0 0 0 sky130_fd_pr__nfet_01v8
M12 N002 D0 3V 3V sky130_fd_pr__pfet_01v8
M13 D0 N002 P002 P002 sky130_fd_pr__nfet_01v8
M14 D0 N002 3V 3V sky130_fd_pr__pfet_01v8
M25 P002 N017 0 0 sky130_fd_pr__nfet_01v8
M26 D0 N017 3V 3V sky130_fd_pr__pfet_01v8
M27 N017 N005 P003 P003 sky130_fd_pr__nfet_01v8
M28 N017 N005 3V 3V sky130_fd_pr__pfet_01v8
M29 P003 N004 0 0 sky130_fd_pr__nfet_01v8
M30 N017 N004 3V 3V sky130_fd_pr__pfet_01v8
M31 N025 N024 P004 P004 sky130_fd_pr__nfet_01v8
M32 N025 N024 3V 3V sky130_fd_pr__pfet_01v8
M33 P004 N004 0 0 sky130_fd_pr__nfet_01v8
M34 N025 N004 3V 3V sky130_fd_pr__pfet_01v8
M35 N024 N005 0 0 sky130_fd_pr__nfet_01v8
M36 N024 N005 3V 3V sky130_fd_pr__pfet_01v8
M37 N003 N023 P005 P005 sky130_fd_pr__nfet_01v8
M38 N003 N023 3V 3V sky130_fd_pr__pfet_01v8
M39 P005 N005 0 0 sky130_fd_pr__nfet_01v8
M40 N003 N005 3V 3V sky130_fd_pr__pfet_01v8
M41 N005 N003 P006 P006 sky130_fd_pr__nfet_01v8
M42 N005 N003 3V 3V sky130_fd_pr__pfet_01v8
M43 P006 N016 0 0 sky130_fd_pr__nfet_01v8
M44 N005 N016 3V 3V sky130_fd_pr__pfet_01v8
M45 N016 N002 P007 P007 sky130_fd_pr__nfet_01v8
M46 N016 N002 3V 3V sky130_fd_pr__pfet_01v8
M47 P007 N001 0 0 sky130_fd_pr__nfet_01v8
M48 N016 N001 3V 3V sky130_fd_pr__pfet_01v8
M49 N023 N022 P008 P008 sky130_fd_pr__nfet_01v8
M50 N023 N022 3V 3V sky130_fd_pr__pfet_01v8
M51 P008 N001 0 0 sky130_fd_pr__nfet_01v8
M52 N023 N001 3V 3V sky130_fd_pr__pfet_01v8
M53 N022 N002 0 0 sky130_fd_pr__nfet_01v8
M54 N022 N002 3V 3V sky130_fd_pr__pfet_01v8
M57 N001 clk 0 0 sky130_fd_pr__nfet_01v8
M58 N001 clk 3V 3V sky130_fd_pr__pfet_01v8
M59 N004 N001 0 0 sky130_fd_pr__nfet_01v8
M60 N004 N001 3V 3V sky130_fd_pr__pfet_01v8
M1 N007 N029 P009 P009 sky130_fd_pr__nfet_01v8
M2 N007 N029 3V 3V sky130_fd_pr__pfet_01v8
M3 P009 D1 0 0 sky130_fd_pr__nfet_01v8
M4 N007 D1 3V 3V sky130_fd_pr__pfet_01v8
M7 D1 N007 P010 P010 sky130_fd_pr__nfet_01v8
M8 D1 N007 3V 3V sky130_fd_pr__pfet_01v8
M9 P010 N019 0 0 sky130_fd_pr__nfet_01v8
M10 D1 N019 3V 3V sky130_fd_pr__pfet_01v8
M15 N019 N010 P011 P011 sky130_fd_pr__nfet_01v8
M16 N019 N010 3V 3V sky130_fd_pr__pfet_01v8
M17 P011 N009 0 0 sky130_fd_pr__nfet_01v8
M18 N019 N009 3V 3V sky130_fd_pr__pfet_01v8
M19 N029 N028 P012 P012 sky130_fd_pr__nfet_01v8
M20 N029 N028 3V 3V sky130_fd_pr__pfet_01v8
M21 P012 N009 0 0 sky130_fd_pr__nfet_01v8
M22 N029 N009 3V 3V sky130_fd_pr__pfet_01v8
M23 N028 N010 0 0 sky130_fd_pr__nfet_01v8
M24 N028 N010 3V 3V sky130_fd_pr__pfet_01v8
M55 N008 N027 P013 P013 sky130_fd_pr__nfet_01v8
M56 N008 N027 3V 3V sky130_fd_pr__pfet_01v8
M61 P013 N010 0 0 sky130_fd_pr__nfet_01v8
M62 N008 N010 3V 3V sky130_fd_pr__pfet_01v8
M63 N010 N008 P014 P014 sky130_fd_pr__nfet_01v8
M64 N010 N008 3V 3V sky130_fd_pr__pfet_01v8
M65 P014 N018 0 0 sky130_fd_pr__nfet_01v8
M66 N010 N018 3V 3V sky130_fd_pr__pfet_01v8
M67 N018 N007 P015 P015 sky130_fd_pr__nfet_01v8
M68 N018 N007 3V 3V sky130_fd_pr__pfet_01v8
M69 P015 N006 0 0 sky130_fd_pr__nfet_01v8
M70 N018 N006 3V 3V sky130_fd_pr__pfet_01v8
M71 N027 N026 P016 P016 sky130_fd_pr__nfet_01v8
M72 N027 N026 3V 3V sky130_fd_pr__pfet_01v8
M73 P016 N006 0 0 sky130_fd_pr__nfet_01v8
M74 N027 N006 3V 3V sky130_fd_pr__pfet_01v8
M75 N026 N007 0 0 sky130_fd_pr__nfet_01v8
M76 N026 N007 3V 3V sky130_fd_pr__pfet_01v8
M77 N006 D0 0 0 sky130_fd_pr__nfet_01v8
M78 N006 D0 3V 3V sky130_fd_pr__pfet_01v8
M79 N009 N006 0 0 sky130_fd_pr__nfet_01v8
M80 N009 N006 3V 3V sky130_fd_pr__pfet_01v8
M81 N012 N033 P017 P017 sky130_fd_pr__nfet_01v8
M82 N012 N033 3V 3V sky130_fd_pr__pfet_01v8
M83 P017 D2 0 0 sky130_fd_pr__nfet_01v8
M84 N012 D2 3V 3V sky130_fd_pr__pfet_01v8
M85 D2 N012 P018 P018 sky130_fd_pr__nfet_01v8
M86 D2 N012 3V 3V sky130_fd_pr__pfet_01v8
M87 P018 N021 0 0 sky130_fd_pr__nfet_01v8
M88 D2 N021 3V 3V sky130_fd_pr__pfet_01v8
M89 N021 N015 P019 P019 sky130_fd_pr__nfet_01v8
M90 N021 N015 3V 3V sky130_fd_pr__pfet_01v8
M91 P019 N014 0 0 sky130_fd_pr__nfet_01v8
M92 N021 N014 3V 3V sky130_fd_pr__pfet_01v8
M93 N033 N032 P020 P020 sky130_fd_pr__nfet_01v8
M94 N033 N032 3V 3V sky130_fd_pr__pfet_01v8
M95 P020 N014 0 0 sky130_fd_pr__nfet_01v8
M96 N033 N014 3V 3V sky130_fd_pr__pfet_01v8
M97 N032 N015 0 0 sky130_fd_pr__nfet_01v8
M98 N032 N015 3V 3V sky130_fd_pr__pfet_01v8
M99 N013 N031 P021 P021 sky130_fd_pr__nfet_01v8
M100 N013 N031 3V 3V sky130_fd_pr__pfet_01v8
M101 P021 N015 0 0 sky130_fd_pr__nfet_01v8
M102 N013 N015 3V 3V sky130_fd_pr__pfet_01v8
M103 N015 N013 P022 P022 sky130_fd_pr__nfet_01v8
M104 N015 N013 3V 3V sky130_fd_pr__pfet_01v8
M105 P022 N020 0 0 sky130_fd_pr__nfet_01v8
M106 N015 N020 3V 3V sky130_fd_pr__pfet_01v8
M107 N020 N012 P023 P023 sky130_fd_pr__nfet_01v8
M108 N020 N012 3V 3V sky130_fd_pr__pfet_01v8
M109 P023 N011 0 0 sky130_fd_pr__nfet_01v8
M110 N020 N011 3V 3V sky130_fd_pr__pfet_01v8
M111 N031 N030 P024 P024 sky130_fd_pr__nfet_01v8
M112 N031 N030 3V 3V sky130_fd_pr__pfet_01v8
M113 P024 N011 0 0 sky130_fd_pr__nfet_01v8
M114 N031 N011 3V 3V sky130_fd_pr__pfet_01v8
M115 N030 N012 0 0 sky130_fd_pr__nfet_01v8
M116 N030 N012 3V 3V sky130_fd_pr__pfet_01v8
M117 N011 D1 0 0 sky130_fd_pr__nfet_01v8
M118 N011 D1 3V 3V sky130_fd_pr__pfet_01v8
M119 N014 N011 0 0 sky130_fd_pr__nfet_01v8
M120 N014 N011 3V 3V sky130_fd_pr__pfet_01v8
.model NMOS NMOS
.model PMOS PMOS
.lib standard.mos
.tran 4m
.backanno
.end